# EAGLE design BluetoothDisplay240 (EAGLE 9.6.2)
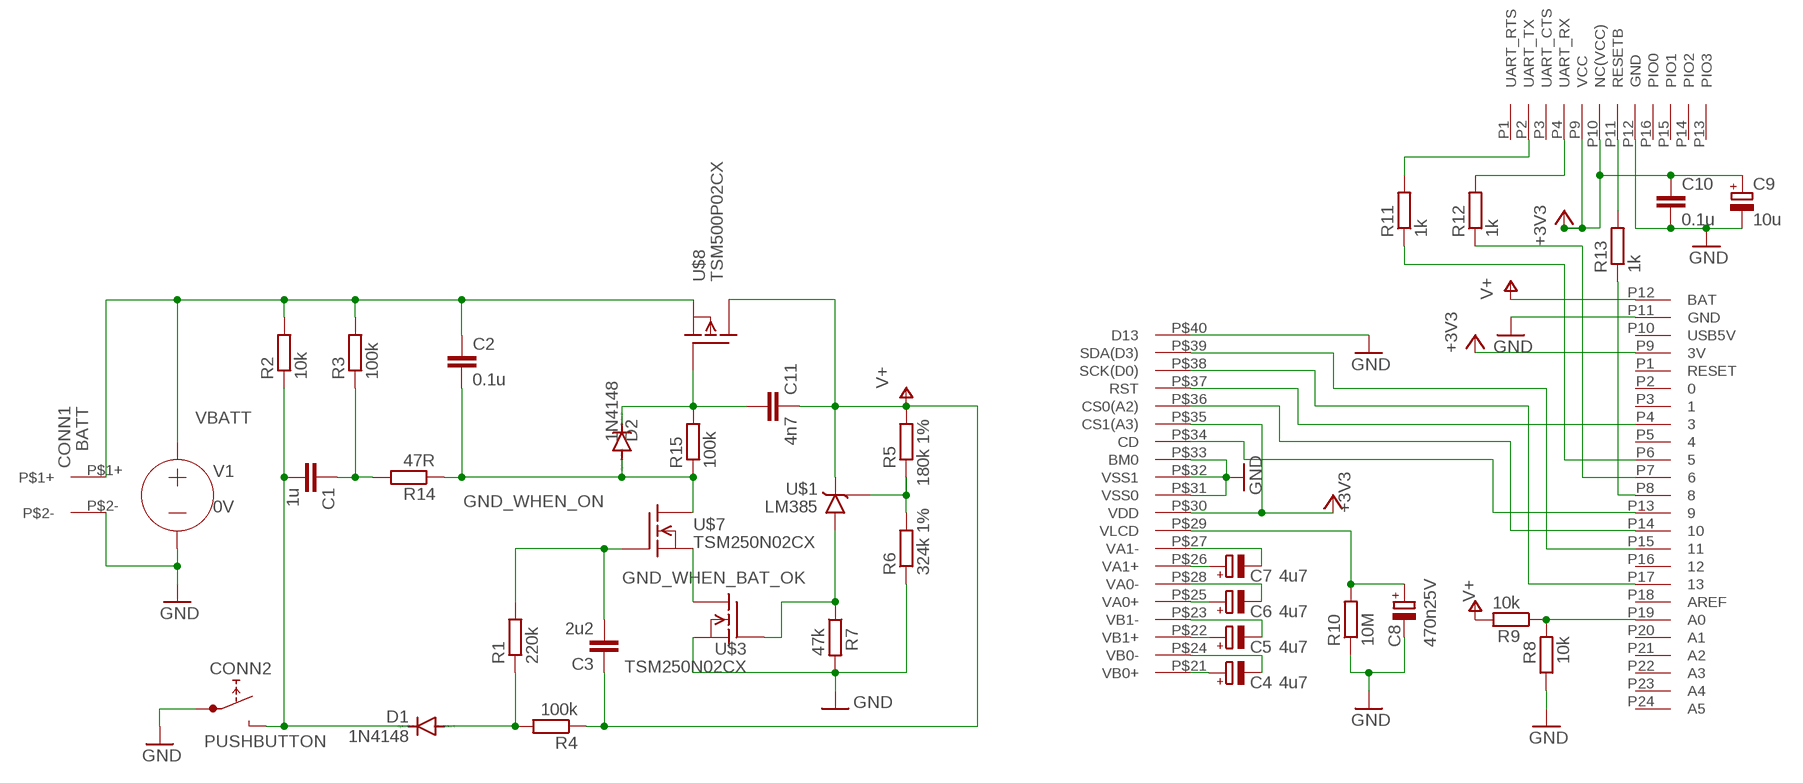
[diagram p0: schematic, sheet 1]

## Parts
C1  1u  C-EU025-060X050  [C025-060X050]
C2  0.1u  C-EU025-030X050  [C025-030X050]
C3  2u2  C-EU075-063X106  [C075-063X106]
C4  4u7  CPOL-EUB45181A  [B45181A]
C5  4u7  CPOL-EUB45181A  [B45181A]
C6  4u7  CPOL-EUB45181A  [B45181A]
C7  4u7  CPOL-EUB45181A  [B45181A]
C8  470n25V  CPOL-EUB45181A  [B45181A]
C9  10u  CPOL-EUB45181A  [B45181A]
C10  0.1u  C-EU025-025X050  [C025-025X050]
C11  4n7  C-EU025-030X050  [C025-030X050]
CONN1  BATT  2-PIN-CONN  [2-PIN_CONN]
CONN2  PUSHBUTTON  EXTERNAL_PUSHBUTTON  [2-PIN_CONN]
D1  1N4148  1N4148DO35-7  [DO35-7]
D2  1N4148  1N4148DO35-7  [DO35-7]
R1  220k  R-EU_0207/10  [0207/10]
R2  10k  R-EU_0207/10  [0207/10]
R3  100k  R-EU_0207/10  [0207/10]
R4  100k  R-EU_0207/10  [0207/10]
R5  180k 1%  R-EU_0207/10  [0207/10]
R6  324k 1%  R-EU_0207/10  [0207/10]
R7  47k  R-EU_0207/10  [0207/10]
R8  10k  R-EU_0207/10  [0207/10]
R9  10k  R-EU_0207/10  [0207/10]
R10  10M  R-EU_0207/10  [0207/10]
R11  1k  R-EU_0207/10  [0207/10]
R12  1k  R-EU_0207/10  [0207/10]
R13  1k  R-EU_0207/10  [0207/10]
R14  47R  R-EU_0207/10  [0207/10]
R15  100k  R-EU_0207/10  [0207/10]
U$1  LM385  [TO92.PAC]
U$3  TSM250N02CX  TSM2302SMD  [SOT23]
U$4  DOGM240-6  [LCD-DISPLAY]
U$5  TRINKET3V  [TRINKET3V]
U$6  HM-17  [HM-17]
U$7  TSM250N02CX  TSM2302SMD  [SOT23]
U$8  TSM500P02CX  [SOT23]
V1  0V  VOLTAGE  (no package)

## Nets
+3V3: C9.+ C10.1 U$4.P$30(VDD) U$4.P$35(CS1(A3)) U$5.P9(3V) U$6.P9(VCC) U$6.P10(NC(VCC))
BT_RES: R13.2 U$6.P11(RESETB)
BT_RES1: R13.1 U$5.P8
BT_RX: R12.2 U$6.P4(UART_RX)
BT_RX1: R12.1 U$5.P7
BT_TX: R11.2 U$6.P2(UART_TX)
BT_TX1: R11.1 U$5.P6
CD_DISP: U$4.P$34(CD) U$5.P13
CS_DISP: U$4.P$36(CS0(A2)) U$5.P14
GND: C8.- C9.- C10.2 CONN1.P$2- CONN2.P$1+(1A) R6.1 R7.2 R8.1 R10.1 U$3.2(S) U$4.P$31(VSS0) U$4.P$32(VSS1) U$4.P$33(BM0) U$4.P$40(D13) U$5.P11(GND) U$6.P12(GND) V1.-
GND_WHEN_BAT_OK: U$3.3(D) U$7.2(S)
GND_WHEN_ON: C2.2 D2.A R14.1 R15.1 U$7.3(D)
HIGH_WHEN_BAT_OK: R7.1 U$1.1(GND) U$3.1(G)
N$1: C4.+ U$4.P$21(VB0+)
N$2: C1.1 R3.1 R14.2
N$3: C4.- U$4.P$24(VB0-)
N$4: C5.+ U$4.P$22(VB1+)
N$10: C5.- U$4.P$23(VB1-)
N$11: C6.+ U$4.P$25(VA0+)
N$12: C6.- U$4.P$28(VA0-)
N$13: C7.+ U$4.P$26(VA1+)
N$14: C7.- U$4.P$27(VA1-)
ON_CTL: C11.2 D2.C R15.2 U$8.1(G)
PUSH_GND: C1.2 CONN2.P$2-(A2) D1.C R2.1
PUSH_GND_2: D1.A R1.1 R4.2
RST_DISP: U$4.P$37(RST) U$5.P4
SCK_DISP: U$4.P$38(SCK(D0)) U$5.P17
SDA_DISP: U$4.P$39(SDA(D3)) U$5.P15
SWITCH_STATE: C3.2 R1.2 U$7.1(G)
V+: C3.1 C11.1 R4.1 R5.2 R9.2 U$1.2(VOUT) U$5.P12(BAT) U$8.3(D)
V+_SENSE: R8.2 R9.1 U$5.P19(A0)
V+LOW_SENSE: R5.1 R6.2 U$1.3(REF)
VBATT: C2.1 CONN1.P$1+ R2.2 R3.2 U$8.2(S) V1.+
VLCD: C8.+ R10.2 U$4.P$29(VLCD)
Unconnected: U$5.P1(RESET) U$5.P2 U$5.P3 U$5.P5 U$5.P10(USB5V) U$5.P16 U$5.P18(AREF) U$5.P20(A1) U$5.P21(A2) U$5.P22(A3) U$5.P23(A4) U$5.P24(A5) U$6.P1(UART_RTS) U$6.P3(UART_CTS) U$6.P13(PIO3) U$6.P14(PIO2) U$6.P15(PIO1) U$6.P16(PIO0)

## Library data of the parts
C1-C3 C10 C11 = rcl:C-EU: CAPACITOR, European symbol; SPICEPREFIX: C
C4-C9 = rcl:CPOL-EU: POLARIZED CAPACITOR, European symbol; SPICEPREFIX: C
CONN1 = myLib:2-PIN-CONN
CONN2 = myLib:EXTERNAL_PUSHBUTTON
D1 D2 = diode:1N4148: DIODE high speed (Philips)
R1-R15 = rcl:R-EU_: RESISTOR, European symbol; SPICEPREFIX: R
U$1 = myLib:LM385
U$3 U$7 = myLib:TSM2302SMD
U$4 = myLib:DOGM240-6: EA DOGM 240-6 LCD Display
U$5 = myLib:TRINKET3V
U$6 = myLib:HM-17
U$8 = myLib:TSM500P02CX
V1 = ngspice-simulation:VOLTAGE: Independent Voltage Source, either DC, AC, PULSE, SINE, PWL, EXP, or SFFM

## Board
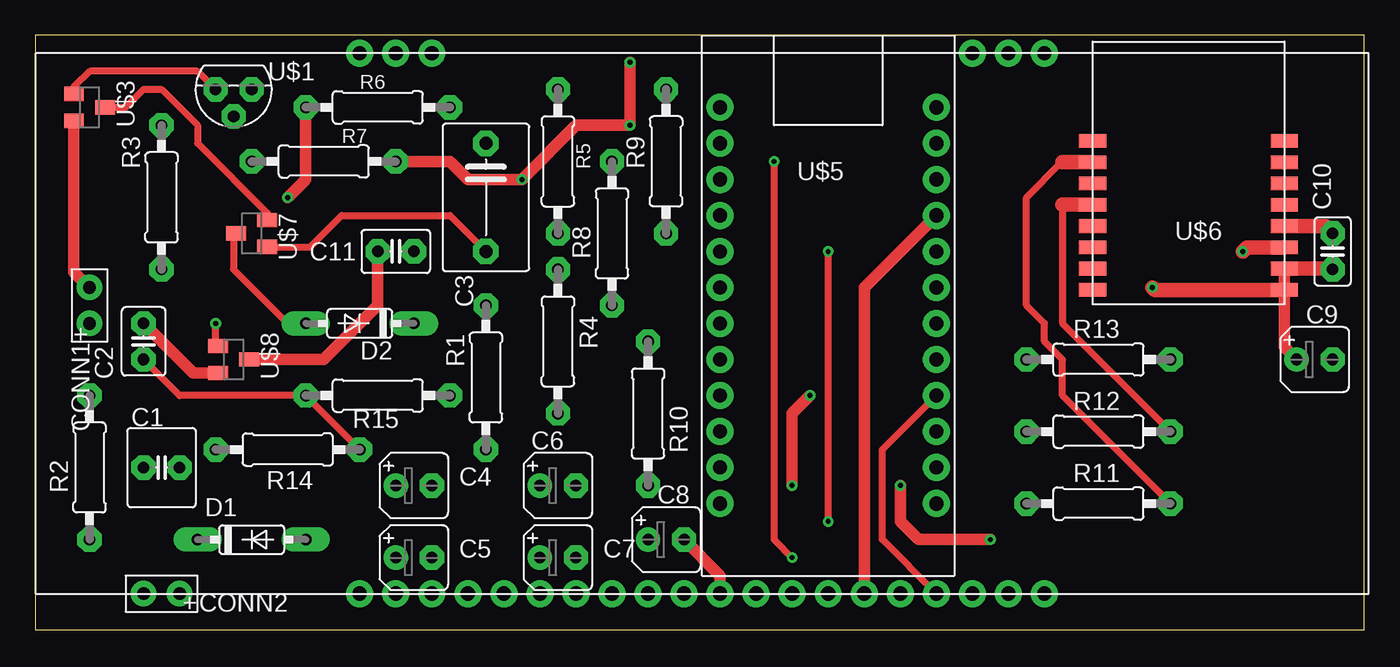
[diagram p1: board, top side]
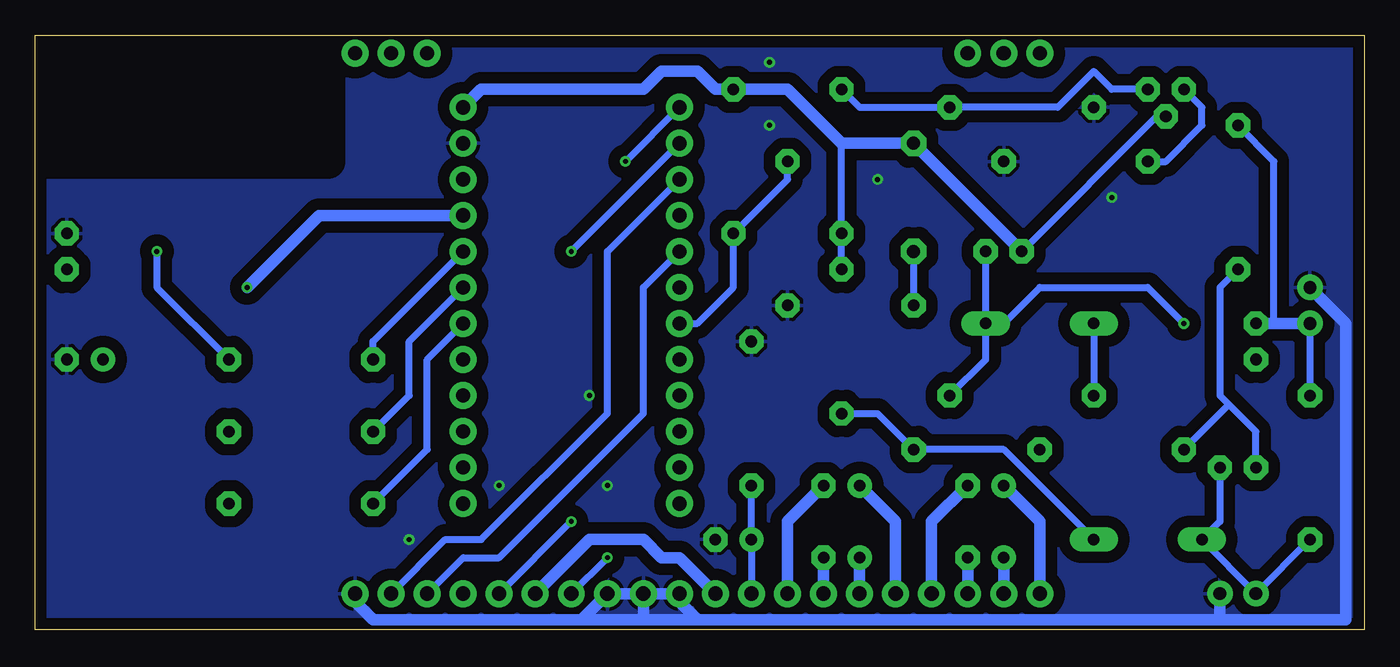
[diagram p2: board, bottom side, seen from below]

Size 93.65 x 41.9 mm. Coordinates in mm from the lower left corner, seen from the top.
Outline: 0,0 93.65,0 93.65,41.9 0,41.9 0,0
Copper layers (1*16): Top 0.035mm / dielectric 1.5mm / Bottom 0.035mm
Design rules "aisler_2_layer_simple *": minimum track width 0.1mm, minimum drill 0.3mm, track to track 0.1mm, track to pad 0.1mm, pad to pad 0.1mm, via to via 0.1mm, smd to smd 0.1mm, copper to edge 0.3mm, drill to drill 0.25mm, minimum pad ring 0.45mm, minimum via ring 0.2mm, stop-mask expansion 0mil, vias tented up to drill 0mil, thermal gap 10mil
bRestrict: area 73,33 to 92.7,41.9

### Footprints (pad centres in the part's own frame; a part is rotated, then mirrored left to right if it is on the bottom)
C025-060X050 = drill 0.813 octagon: 1 -1.27,0; 2 1.27,0
C025-030X050 = drill 0.813 octagon: 1 -1.27,0; 2 1.27,0
C075-063X106 = drill 0.914 octagon: 1 -3.81,0; 2 3.81,0
B45181A = drill 0.813 pad 1.6: + -1.27,0 | drill 0.813 pad 1.6 octagon: - 1.27,0
C025-025X050 = drill 0.813 octagon: 1 -1.27,0; 2 1.27,0
2-PIN_CONN = drill 0.9: P$1+ -1.27,0; P$2- 1.27,0
DO35-7 = drill 0.813 long: A 3.81,0; C -3.81,0
0207/10 = drill 0.813 octagon: 1 -5.08,0; 2 5.08,0
TO92.PAC = drill 0.813 octagon: 1 1.27,0; 2 0,1.905; 3 -1.27,0
SOT23 = smd 1 x 1.4: 1 -0.95,-1.1; 2 0.95,-1.1; 3 0,1.1
LCD-DISPLAY = drill 1: P$1 -24.13,38.1; P$2 -21.59,38.1; P$3 -19.05,38.1; P$4 24.13,38.1; P$5 21.59,38.1; P$6 19.05,38.1; P$21 -24.13,0; P$22 -21.59,0; P$23 -19.05,0; P$24 -16.51,0; P$25 -13.97,0; P$26 -11.43,0; P$27 -8.89,0; P$28 -6.35,0; P$29 -3.81,0; P$30 -1.27,0; P$31 1.27,0; P$32 3.81,0; P$33 6.35,0; P$34 8.89,0; P$35 11.43,0; P$36 13.97,0; P$37 16.51,0; P$38 19.05,0; P$39 21.59,0; P$40 24.13,0
TRINKET3V = drill 1: P1 -7.62,12.7; P2 -7.62,10.16; P3 -7.62,7.62; P4 -7.62,5.08; P5 -7.62,2.54; P6 -7.62,0; P7 -7.62,-2.54; P8 -7.62,-5.08; P9 -7.62,-7.62; P10 -7.62,-10.16; P11 -7.62,-12.7; P12 -7.62,-15.24; P13 7.62,-15.24; P14 7.62,-12.7; P15 7.62,-10.16; P16 7.62,-7.62; P17 7.62,-5.08; P18 7.62,-2.54; P19 7.62,0; P20 7.62,2.54; P21 7.62,5.08; P22 7.62,7.62; P23 7.62,10.16; P24 7.62,12.7
HM-17 = smd 1.93 x 0.965: P1 -6.75,5.25; P2 -6.75,3.75; P3 -6.75,2.25; P4 -6.75,0.75; P5 -6.75,-0.75; P6 -6.75,-2.25; P7 -6.75,-3.75; P8 -6.75,-5.25; P9 6.75,-5.25; P10 6.75,-3.75; P11 6.75,-2.25; P12 6.75,-0.75; P13 6.75,0.75; P14 6.75,2.25; P15 6.75,3.75; P16 6.75,5.25

### Placement (x,y rotation side)
C1  8.89,11.43 0 top
C2  7.62,20.32 270 top
C3  31.75,30.48 270 top
C4  26.67,10.16 0 top
C5  26.67,5.08 0 top
C6  36.83,10.16 0 top
C7  36.83,5.08 0 top
C8  44.45,6.35 0 top
C9  90.17,19.05 0 top
C10  91.44,26.67 90 top
C11  25.4,26.67 0 top
CONN1  3.81,22.86 90 top
CONN2  8.89,2.54 180 top
D1  15.24,6.35 0 top
D2  22.86,21.59 180 top
R1  31.75,17.78 90 top
R2  3.81,11.43 90 top
R3  8.89,30.48 90 top
R4  36.83,20.32 270 top
R5  36.83,33.02 270 top
R6  24.13,36.83 0 top
R7  20.32,33.02 0 top
R8  40.64,27.94 90 top
R9  44.45,33.02 90 top
R10  43.18,15.24 270 top
R11  74.93,8.89 0 top
R12  74.93,13.97 0 top
R13  74.93,19.05 0 top
R14  17.78,12.7 180 top
R15  24.13,16.51 0 top
U$1  13.97,38.1 180 top
U$3  3.81,36.83 270 top
U$4  46.99,2.54 0 top
U$5  55.88,21.59 180 top
U$6  81.28,29.21 0 top
U$7  15.24,27.94 90 top
U$8  13.97,19.05 270 top

### Tracks (layer width: path | path; a pad name or v marks a point on that pad's centre or on a via)
+3V3  (via drill 0.35)
  Top 0.813: U$4.P$35 58.42,24.13 U$5.P9 | C9.+ 88.03,19.92 88.03,23.73 U$6.P9 U$6.P10
  Top 1.016: U$6.P10 91.38,25.46 C10.1 | U$6.P9 78.91,23.96 v78.74,24.13
  Bottom 0.813: U$4.P$30 48.26,5.08 49.53,5.08 50.8,6.35 54.61,6.35 U$4.P$35 | U$5.P9 73.66,29.21 v78.74,24.13
BT_RES  (via drill 0.35)
  Top 1.016: U$6.P11 85.38,26.96 v85.09,26.67
  Bottom 0.508: v85.09,26.67 85.09,24.13 R13.2
BT_RES1
  Bottom 0.508: R13.1 69.85,20.32 U$5.P8
BT_RX
  Top 0.508: R12.2 72.39,21.59 72.39,29.96
  Top 1.016: U$6.P4 72.39,29.96
BT_RX1
  Bottom 0.508: R12.1 67.31,16.51 67.31,20.32 U$5.P7
BT_TX
  Top 0.508: R11.2 72.39,16.51 72.39,19.05 71.12,20.32 71.12,21.59 69.85,22.86 69.85,30.48 72.33,32.96 72.39,32.96
  Top 1.016: U$6.P2 72.39,32.96
BT_TX1
  Bottom 0.508: R11.1 66.04,12.7 66.04,19.05 U$5.P6
CD_DISP  (via drill 0.35)
  Top 0.508: v52.07,33.02 52.07,6.35 v53.34,5.08
  Bottom 0.508: U$4.P$34 v53.34,5.08 | v52.07,33.02 U$5.P13
CS_DISP  (via drill 0.35)
  Top 0.508: v55.88,7.62 v55.88,26.67
  Bottom 0.508: U$4.P$36 v55.88,7.62 | v55.88,26.67 U$5.P14
GND  (via drill 0.35)
  Top 0.813: U$4.P$31 48.26,3.81 C8.- | 90.92,28.46 C10.2 | v53.34,10.16 53.34,15.24 v54.61,16.51 | U$3.2 2.71,25.23 CONN1.P$2- | v41.91,40.01 v41.91,35.56 38.1,35.56 v34.29,31.75 30.48,31.75 29.21,33.02 R7.2 | v17.78,30.48 19.05,31.75 R6.1 | v60.96,10.16 60.96,7.62 62.23,6.35 v67.31,6.35
  Top 1.016: U$6.P12 90.92,28.46
  Bottom 0.813: U$4.P$32 U$4.P$31 48.26,1.98 46.99,0.71 | U$4.P$32 U$4.P$33 55.17,0.71 | 55.17,0.71 69.85,0.71 71.12,1.98 U$4.P$40 | 10.16,0.71 46.99,0.71 | 10.16,0.71 1.27,0.71 1.27,21.59 CONN1.P$2- | CONN2.P$1+ 10.16,0.71 | 46.99,0.71 50.8,0.71 | 50.8,0.71 55.17,0.71 | 50.8,0.71 U$4.P$32
  pour Bottom (isolate 0.813): 0.64,41.27 0.64,0.64 93.34,0.64 93.34,41.27
GND_WHEN_BAT_OK
  Top 0.508: U$7.2 16.34,29.38 11.43,34.29 11.43,35.56 8.89,38.1 7.62,38.1 6.35,36.83 U$3.3
GND_WHEN_ON
  Top 0.508: U$7.3 13.97,27.77 13.97,25.4 17.78,21.59 D2.A | R14.1 R15.1 10.16,16.51 C2.2
  Bottom 0.508: D2.A R15.1
HIGH_WHEN_BAT_OK
  Top 0.508: U$3.1 2.71,38.27 3.81,39.37 11.43,39.37 U$1.1
  Bottom 0.508: R7.1 13.97,33.02 11.43,35.56 11.43,36.83 U$1.1
N$1
  Bottom 0.813: U$4.P$21 22.86,7.62 C4.+
N$2
  Bottom 0.508: C1.1 7.62,13.97 9.53,15.88 | R3.1 10.16,24.13 10.16,16.51 9.53,15.88 | R14.2 9.53,15.88
N$3
  Bottom 0.813: C4.- 30.48,7.62 U$4.P$24
N$4
  Bottom 0.813: U$4.P$22 C5.+
N$10
  Bottom 0.813: U$4.P$23 C5.-
N$11
  Bottom 0.813: U$4.P$25 33.02,7.62 C6.+
N$12
  Bottom 0.813: U$4.P$28 40.64,7.62 C6.-
N$13
  Bottom 0.813: U$4.P$26 C7.+
N$14
  Bottom 0.813: U$4.P$27 C7.-
ON_CTL  (via drill 0.35)
  Top 0.508: U$8.1 12.7,20.17 v12.7,21.59
  Bottom 0.508: D2.C C11.2 | R15.2 26.67,19.05 D2.C | D2.C 25.4,21.59 22.86,24.13 15.24,24.13 v12.7,21.59
PUSH_GND
  Bottom 0.508: C1.2 10.16,7.62 D1.C CONN2.P$2- R2.1
PUSH_GND_2
  Bottom 0.508: R4.2 34.29,15.24 R1.1 25.4,12.7 D1.A
RST_DISP
  Top 0.508: U$4.P$37 59.69,6.35 59.69,12.7 U$5.P4
SCK_DISP
  Bottom 0.508: U$4.P$38 63.5,5.08 60.96,5.08 50.8,15.24 50.8,24.13 U$5.P17
SDA_DISP
  Bottom 0.508: U$4.P$39 64.77,6.35 62.23,6.35 53.34,15.24 53.34,26.67 U$5.P15
SWITCH_STATE
  Top 0.508: U$7.1 19.37,26.99 21.59,29.21 29.21,29.21 C3.2
  Bottom 0.508: C3.2 R1.2
V+
  Top 0.813: U$8.3 20.32,19.05 24.13,22.86 C11.1
  Bottom 0.508: U$1.2 14.61,36.2 C11.1 | R4.1 R5.2 36.83,34.29
  Bottom 0.813: U$5.P12 62.23,38.1 50.8,38.1 49.53,39.37 46.99,39.37 45.72,38.1 R9.2 40.64,38.1 36.83,34.29 C3.1 C11.1
V+_SENSE
  Bottom 0.508: U$5.P19 46.99,21.59 44.45,24.13 R9.1 40.64,31.75 R8.2
V+LOW_SENSE
  Bottom 0.508: R5.1 35.56,36.83 R6.2 21.59,36.83 19.05,39.37 17.78,38.1 U$1.3
VBATT
  Top 0.813: U$8.2 11.11,18.1 C2.1
  Bottom 0.508: 6.35,21.59 6.35,33.02 R3.2 | CONN1.P$1+ R2.2
  Bottom 0.813: C2.1 6.35,21.59 CONN1.P$1+
VLCD
  Bottom 0.508: U$4.P$29 C8.+ R10.2